# Altium schematic sheet alarm_timing.SchDoc
size A; SheetNumber: 1; SheetTotal: 2
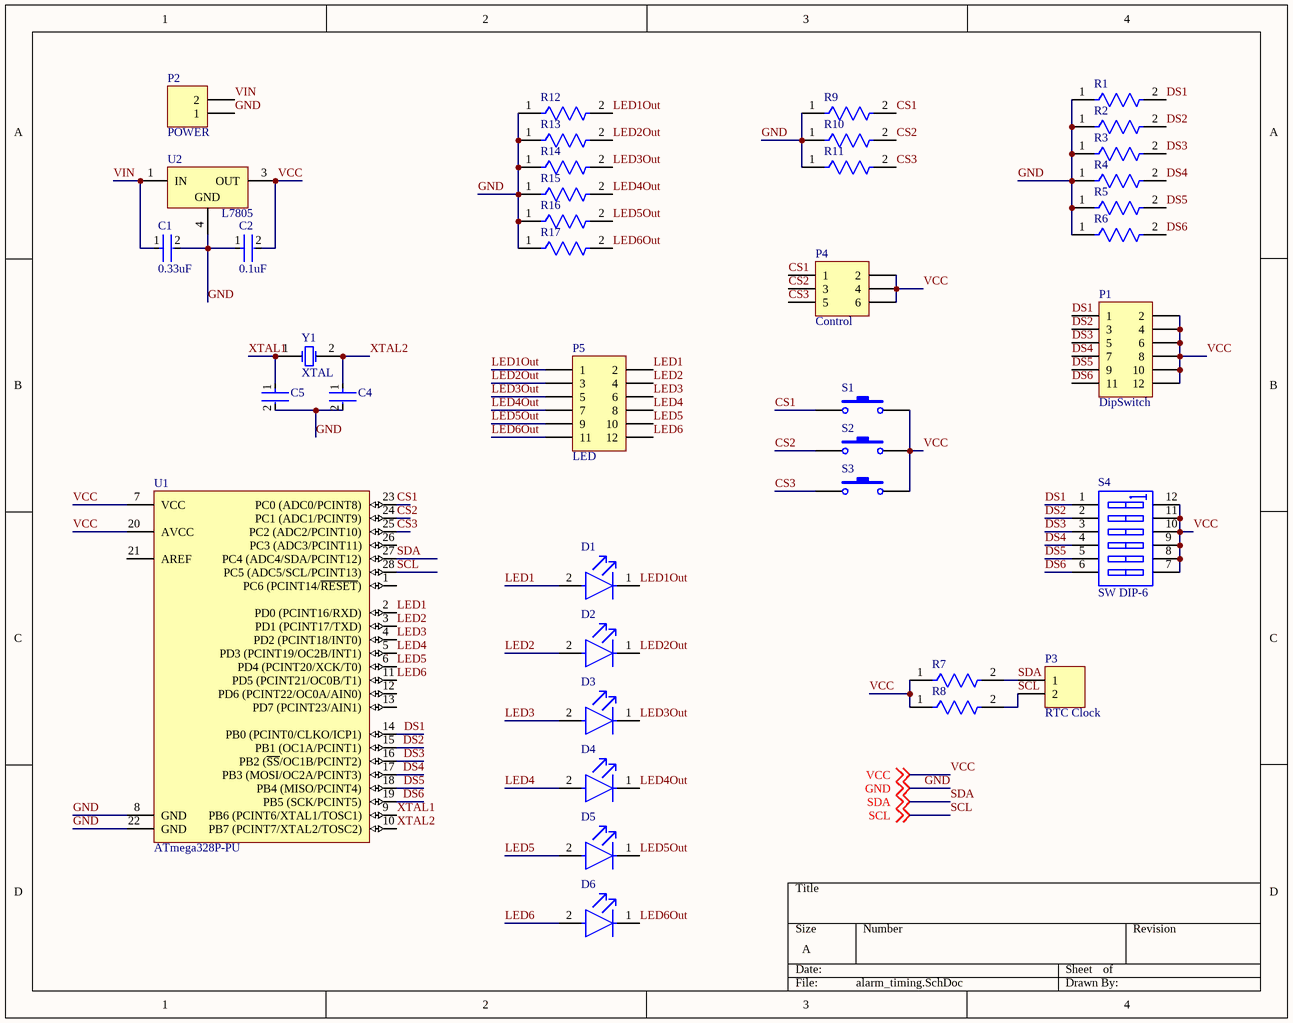
[diagram p0: alarm_timing.SchDoc]

## Parts
C1  0.33uF  [FP-C1206C-EB-MFG]
C2  0.1uF  [FP-C1206C-EB-MFG]
C4  (no value)  [FP-C1206C-EB-MFG]
C5  (no value)  [FP-C1206C-EB-MFG]
D1  (no value)  [FP-598-82-MFG]
D2  (no value)  [FP-598-82-MFG]
D3  (no value)  [FP-598-82-MFG]
D4  (no value)  [FP-598-82-MFG]
D5  (no value)  [FP-598-82-MFG]
D6  (no value)  [FP-598-82-MFG]
P1  DipSwitch  [HDR2X6]
P2  POWER  [HDR1X2]
P3  RTC Clock  [HDR1X2]
P4  Control  [HDR2X3]
P5  LED  [HDR2X6]
R1  (no value)  [FP-CR1206-IPC_B]
R2  (no value)  [FP-CR1206-IPC_B]
R3  (no value)  [FP-CR1206-IPC_B]
R4  (no value)  [FP-CR1206-IPC_B]
R5  (no value)  [FP-CR1206-IPC_B]
R6  (no value)  [FP-CR1206-IPC_B]
R7  (no value)  [FP-CR1206-IPC_B]
R8  (no value)  [FP-CR1206-IPC_B]
R9  (no value)  [FP-CR1206-IPC_B]
R10  (no value)  [FP-CR1206-IPC_B]
R11  (no value)  [FP-CR1206-IPC_B]
R12  (no value)  [FP-CR1206-IPC_B]
R13  (no value)  [FP-CR1206-IPC_B]
R14  (no value)  [FP-CR1206-IPC_B]
R15  (no value)  [FP-CR1206-IPC_B]
R16  (no value)  [FP-CR1206-IPC_B]
R17  (no value)  [FP-CR1206-IPC_B]
S1  (no value)  [SPST-2]
S2  (no value)  [SPST-2]
S3  (no value)  [SPST-2]
S4  SW DIP-6  [DIP-12/SW]
U1  ATmega328P-PU  [28P3]
U2  L7805  [TO-263_N]
Y1  XTAL  [R38]

## Nets
CS1: P4.1 R9.2 S1.1 U1.23(PC0_(ADC0/PCINT8))
CS2: P4.3 R10.2 S2.1 U1.24(PC1_(ADC1/PCINT9))
CS3: P4.5 R11.2 S3.1 U1.25(PC2_(ADC2/PCINT10))
DS1: P1.1 R1.2 S4.1(A1) U1.14(PB0_(PCINT0/CLKO/ICP1))
DS2: P1.3 R2.2 S4.2(A2) U1.15(PB1_(OC1A/PCINT1))
DS3: P1.5 R3.2 S4.3(A3) U1.16(PB2_(~{SS}/OC1B/PCINT2))
DS4: P1.7 R4.2 S4.4(A4) U1.17(PB3_(MOSI/OC2A/PCINT3))
DS5: P1.9 R5.2 S4.5(A5) U1.18(PB4_(MISO/PCINT4))
DS6: P1.11 R6.2 S4.6(A6) U1.19(PB5_(SCK/PCINT5))
GND: C1.2 C2.1 C4.2 C5.2 P2.1 R1.1 R2.1 R3.1 R4.1 R5.1 R6.1 R9.1 R10.1 R11.1 R12.1 R13.1 R14.1 R15.1 R16.1 R17.1 U1.8(GND) U1.22(GND) U2.4(GND) ; off-sheet GND
LED1: D1.2(A) P5.2 U1.2(PD0_(PCINT16/RXD))
LED1Out: D1.1(C) P5.1 R12.2
LED2: D2.2(A) P5.4 U1.3(PD1_(PCINT17/TXD))
LED2Out: D2.1(C) P5.3 R13.2
LED3: D3.2(A) P5.6 U1.4(PD2_(PCINT18/INT0))
LED3Out: D3.1(C) P5.5 R14.2
LED4: D4.2(A) P5.8 U1.5(PD3_(PCINT19/OC2B/INT1))
LED4Out: D4.1(C) P5.7 R15.2
LED5: D5.2(A) P5.10 U1.6(PD4_(PCINT20/XCK/T0))
LED5Out: D5.1(C) P5.9 R16.2
LED6: D6.2(A) P5.12 U1.11(PD5_(PCINT21/OC0B/T1))
LED6Out: D6.1(C) P5.11 R17.2
SCL: P3.2 R8.2 U1.28(PC5_(ADC5/SCL/PCINT13)) ; off-sheet SCL
SDA: P3.1 R7.2 U1.27(PC4_(ADC4/SDA/PCINT12)) ; off-sheet SDA
VCC: C2.2 P1.2 P1.4 P1.6 P1.8 P1.10 P1.12 P4.2 P4.4 P4.6 R7.1 R8.1 S1.2 S2.2 S3.2 S4.7(B6) S4.8(B5) S4.9(B4) S4.10(B3) S4.11(B2) S4.12(B1) U1.7(VCC) U1.20(AVCC) U2.3(OUT) ; off-sheet VCC
VIN: C1.1 P2.2 U2.1(IN)
XTAL1: C5.1 U1.9(PB6_(PCINT6/XTAL1/TOSC1)) Y1.1(OSC1)
XTAL2: C4.1 U1.10(PB7_(PCINT7/XTAL2/TOSC2)) Y1.2(OSC2)

Not connected (* = marked no-connect by the designer): U1 1(PC6_(PCINT14/~{RESET})) 12(PD6_(PCINT22/OC0A/AIN0)) 13(PD7_(PCINT23/AIN1)) 21(AREF) 26(PC3_(ADC3/PCINT11))

## Library data of the parts
C1 C2 = CMP-03020-001426-1: 1206 C 330nF Ceramic Multilayer Capacitor; 25 VDC; +125degC; X7R Dielec; +/-10%; Manufacturer: KEMET; Manufacturer Part Number: C1206C334K3RACTU; Capacitance: 0.33 μF; Value: 0.33 μF; Voltage Rating: 25 V; Tolerance: 0.1; Automotive Grade: Grade 0; Temperature Coefficient: 15%; Digikey Description: 1206 C 330nF Ceramic Multilayer Capacitor; 25 VDC; +125degC; X7R Dielec; +/-10%; Package: C1206C-EB; Temperature: -55°C to +150°C; Category: Cap; Device Class L1: Passive Components; Lead Free: Yes; ComponentLink2Description: Datasheet; Material: Ceramic; Automotive: Yes; Temperature Range Low: -55°C; Height: 0.88mm; Octopart: https://octopart.com/c1206c334k3ractu-kemet-133095; Mouser Description: Multilayer Ceramic Capacitors MLCC - SMD/SMT 25volts 0.33uF X7R 10%; ComponentLink2URL: https://content.kemet.com/datasheets/KEM_C1007_X8R_ULTRA_150C_SMD.pdf; Temperature Range High: +150°C; Ipc Land Pattern Name: CAPC320160X78; RoHS: TRUE; Temperature Characteristic: X7R; Device Class L2: Capacitors; Device Class L3: Ceramic Capacitors
C4 C5 = CMP-03020-000153-1: CAP CER 0.1UF 100V X7R 1206; Manufacturer: KEMET; Manufacturer Part Number: C1206C104K1RACTU; Value: 0.10 μF; Tolerance: 0.1; Description: C1206 0.10 μF X7R 10.00% 100 V; Material: Ceramic; Temperature Coefficient: 15%; Automotive Grade: Grade 0; Voltage Rating: 100 V; Automotive: Yes; Ipc Land Pattern Name: CAPC320160X78; Device Class L1: Passive Components; ComponentLink2Description: Datasheet; Temperature Range Low: -55°C; Category: Cap; Octopart: https://octopart.com/c1206c104k1ractu-kemet-89521; Height: 0.88mm; Lead Free: Yes; Digikey Description: CAP CER 0.1UF 100V X7R 1206; Mouser Description: CAP CER 0.1UF 100V X7R 1206; Device Class L3: Ceramic Capacitors; Device Class L2: Capacitors; ComponentLink2URL: https://content.kemet.com/datasheets/KEM_C1007_X8R_ULTRA_150C_SMD.pdf; Temperature Range High: +150°C; Temperature Characteristic: X7R; RoHS: TRUE; Capacitance: 0.10 μF; Package: C1206C-EB; Temperature: -55°C to +150°C
D1-D6 = CMP-15384-000005-1: LED RED CLEAR 1206 SMD; Manufacturer Part Number: 598-8210-107F; Manufacturer: Dialight; Wavelength: 633nm; Viewing Angle: 140°; Led Orientation: Top View; Max Junction Temp: +105°C; Forward Voltage: 2.1V; Luminous Intensity: 55mcd; Power Dissipation: 72mW; Forward Current: 20mA; Reverse Voltage: 5V; Temperature Range Low: -40°C; Automotive: No; ComponentLink2URL: http://www.dialightsignalsandcomponents.com/Assets/Brochures_And_Catalogs/Indication/CBI_SMD_new/Dialight_CBI_data_598-1206_Apr2018.pdf; RoHS: TRUE; Octopart: https://octopart.com/598-8210-107f-dialight-868600; Device Class L3: unset; ComponentLink2Description: Datasheet; Lead Free: Yes; Mouser Description: 598 Series Red 1206 3.2 x 1.6 x 0.7 mm 140° Water Clear 55 mcd 2 V LED SMT; Temperature: -40°C to +100°C; Height: 0.9mm; Device Class L1: Optoelectronics; Category: Diode; Device Class L2: LEDs; Temperature Range High: +100°C; Package: 598-82; Colour: Red; Digikey Description: LED RED CLEAR 1206 SMD
P1 P5 = Header 6X2: Header, 6-Pin, Dual row; LatestRevisionDate: 17-Jul-2002; LatestRevisionNote: Re-released for DXP Platform.; Publisher: Altium Limited
P2 P3 = Header 2: Header, 2-Pin; LatestRevisionDate: 17-Jul-2002; LatestRevisionNote: Re-released for DXP Platform.; Publisher: Altium Limited
P4 = Header 3X2: Header, 3-Pin, Dual row; LatestRevisionDate: 17-Jul-2002; LatestRevisionNote: Re-released for DXP Platform.; Publisher: Altium Limited
R1-R17 = CMP-07231-005593-1: Thick Film Chip Resistors 1206 10kΩ 0.25W 5% 200ppm/°C; Voltage Rating: 200V; Resistance: 10kR; Max Power Dissipation: 250mW; Temperature Coefficient: 200ppm/°C; Height: 0.6mm; Case Code (Imperial): 1206; REACH SVHC: No SVHC; Depth: 1.6mm; Mount: Surface Mount; Termination: SMD/SMT; Case/Package: 1206; Min Operating Temperature: -55°C; Features: Moisture Resistant; Number of Pins: 2; Length: 3.2mm; Military Standard: Not; Radiation Hardening: No; Max Operating Temperature: 155°C; Power Rating: 250mW; Case Code (Metric): 3216; Package Quantity: 1; Composition: Thick Film; Tolerance: 5%; Voltage Rating (DC): 200V; Contact Plating: Tin; Thickness: 610um; Number of Terminations: 2; Packaging: Tape and Reel; Width: 1.6mm
S1-S3 = SW-PB: Switch; Published: 24-Mar-1999; LatestRevisionDate: 17-Jul-2002; LatestRevisionNote: Re-released for DXP Platform.; PackageReference: SPST-2; Publisher: Altium Limited; PackageDescription: Switch; 2 Leads
S4 = SW DIP-6: DIP Switch, 6 Position, SPST; Published: 24-Mar-1999; LatestRevisionDate: 17-Jul-2002; LatestRevisionNote: Re-released for DXP Platform.; PackageReference: DIP-12/SW; Publisher: Altium Limited; PackageDescription: DIP Switch; 12 Leads
U1 = CMP-0095-00013-2: 8-bit AVR Microcontroller, 32KB Flash, 1KB EEPROM, 2KB SRAM, 28-pin PDIP, Industrial Grade (-40°C to 85°C); RevisionNote: DatasheetVersion updated. URLs added.; PackageVersion: revB, Sep-2001; PackageDescription: 28-lead (0.300"/7.62mm Wide) Plastic Dual Inline Package (PDIP); DatasheetVersion: revD, May-2011; ComponentLink1Description: Manufacturer URL; ComponentLink1URL: http://www.atmel.com/; PackageReference: 28P3; ComponentLink2Description: ATmega48A/48PA/88A/88PA/168A/168PA/328/328P Datasheet; ComponentLink3URL: http://www.atmel.com/dyn/resources/prod_documents/8271S.pdf; ComponentLink2URL: http://www.atmel.com/dyn/resources/prod_documents/8271.pdf; ComponentLink3Description: ATmega48A/48PA/88A/88PA/168A/168PA/328/328P Summary
U2 = CMP-0244-00214-1: Positive Voltage Regulator, 3-Pin D2PAK, Tape and Reel; DatasheetVersion: 16/11/2011; PackageVersion: 2011; PackageReference: TO-263; PackageDescription: 3-Pin Transistor Outline Package 2.54 mm Pitch, 15.4 mm Lead Span (D2PAK); ComponentLink2URL: http://www.st.com/internet/com/TECHNICAL_RESOURCES/TECHNICAL_LITERATURE/DATASHEET/CD00000444.pdf; ComponentLink1URL: http://www.st.com; ComponentLink1Description: Manufacturer URL; ComponentLink2Description: Datasheet
Y1 = XTAL: Crystal Oscillator; Published: 8-Jun-2000; LatestRevisionDate: 17-Jul-2002; LatestRevisionNote: Re-released for DXP Platform.; PackageReference: R38; Publisher: Altium Limited; PackageDescription: Crystal, Thru-Hole; 2 Leads; Body 3.1 x 8.2 mm (Dia.xH)